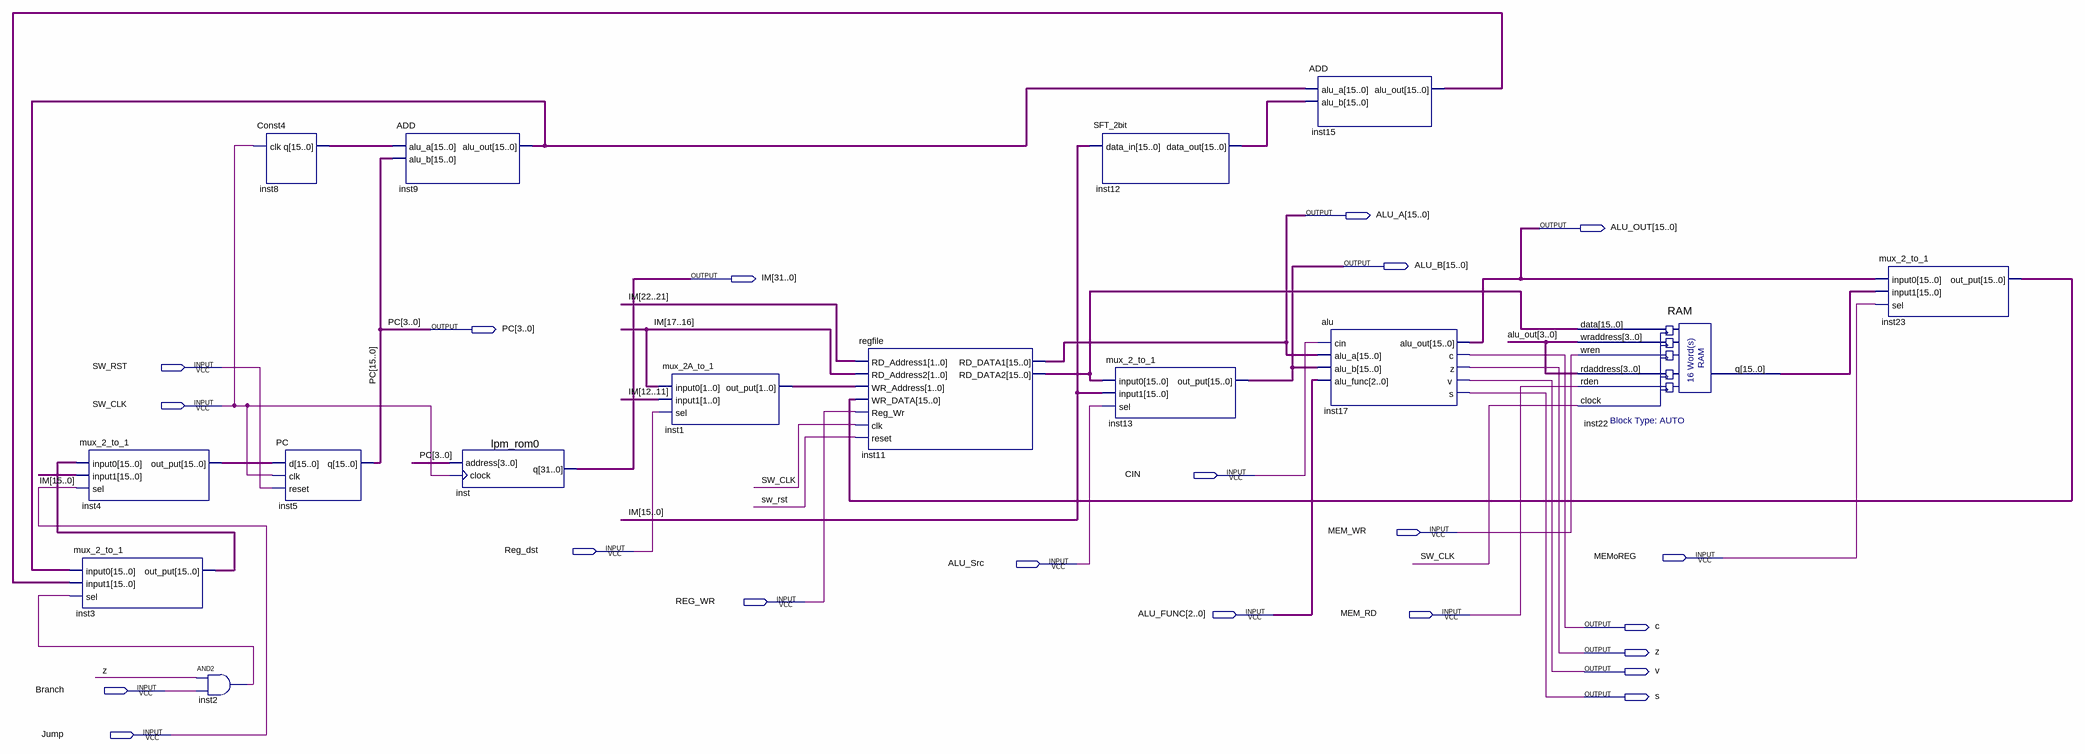
[diagram p0: schematic sheet]
// Quartus schematic Controller.bdf as structural Verilog: 15 symbols, 21 pins
module Controller (
  input  SW_RST,
  input  SW_CLK,
  input  CIN,
  input  MEM_WR,
  input  Reg_dst,
  input  MEMoREG,
  input  ALU_Src,
  input  REG_WR,
  input  [2:0] ALU_FUNC,
  input  MEM_RD,
  input  Branch,
  input  Jump,
  output [15:0] ALU_A,
  output [15:0] ALU_OUT,
  output [15:0] ALU_B,
  output [31:0] IM,
  output [15:0] PC,
  output c,
  output z,
  output v,
  output s
);

  wire inst2_out;
  wire [1:0] inst1_out_put;
  wire [15:0] inst3_out_put, inst4_out_put, inst8_q, inst9_alu_out, inst11_rd_data2, inst12_data_out,
       inst15_alu_out, inst22_q, inst23_out_put;

  mux_2_to_1 inst4 (.input0(inst3_out_put), .input1(IM[15:0]), .sel(Jump), .out_put(inst4_out_put));
  mux_2_to_1 inst3 (.input0(inst9_alu_out), .input1(inst15_alu_out), .sel(inst2_out), .out_put(inst3_out_put));
  and inst2 (inst2_out, z, Branch);
  Const4 inst8 (.clk(SW_CLK), .q(inst8_q));
  PC inst5 (.d(inst4_out_put), .clk(SW_CLK), .reset(SW_RST), .q(PC));
  ADD inst9 (.alu_a(inst8_q), .alu_b(PC), .alu_out(inst9_alu_out));
  lpm_rom0 inst (.address(PC[3:0]), .clock(SW_CLK), .q(IM));
  mux_2A_to_1 inst1 (.input0(IM[17:16]), .input1(IM[12:11]), .sel(Reg_dst), .out_put(inst1_out_put));
  regfile inst11 (
    .RD_Address1(IM[22:21]), .RD_Address2(IM[17:16]), .WR_Address(inst1_out_put), .WR_DATA(inst23_out_put),
    .Reg_Wr(REG_WR), .clk(SW_CLK), .reset(SW_RST), .RD_DATA1(ALU_A), .RD_DATA2(inst11_rd_data2));
  SFT_2bit inst12 (.data_in(IM[15:0]), .data_out(inst12_data_out));
  mux_2_to_1 inst13 (.input0(inst11_rd_data2), .input1(IM[15:0]), .sel(ALU_Src), .out_put(ALU_B));
  ADD inst15 (.alu_a(inst9_alu_out), .alu_b(inst12_data_out), .alu_out(inst15_alu_out));
  alu inst17 (
    .cin(CIN), .alu_a(ALU_A), .alu_b(ALU_B), .alu_func(ALU_FUNC), .alu_out(ALU_OUT), .c(c), .z(z), .v(v),
    .s(s));
  RAM inst22 (
    .data(inst11_rd_data2), .wraddress(ALU_OUT[3:0]), .wren(MEM_WR), .rdaddress(ALU_OUT[3:0]), .rden(MEM_RD),
    .clock(SW_CLK), .q(inst22_q));
  mux_2_to_1 inst23 (.input0(ALU_OUT), .input1(inst22_q), .sel(MEMoREG), .out_put(inst23_out_put));
endmodule
